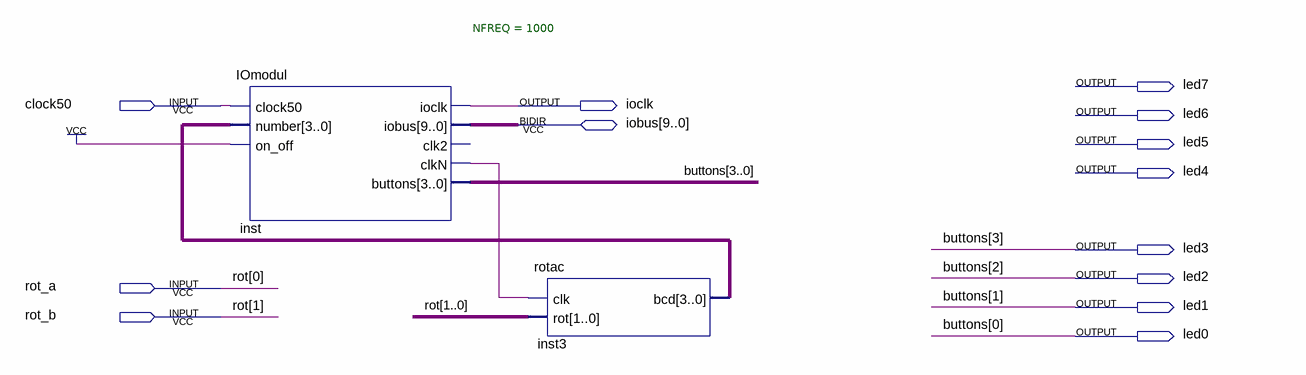
[diagram p0: schematic sheet]
// Quartus schematic logika.bdf as structural Verilog: 2 symbols, 13 pins
module logika (
  input  clock50,
  input  rot_a,
  input  rot_b,
  inout  [9:0] iobus,
  output led7,
  output ioclk,
  output led6,
  output led5,
  output led4,
  output led3,
  output led2,
  output led1,
  output led0
);

  wire inst_clkn;
  wire [3:0] inst3_bcd;

  IOmodul #(.NFREQ(1000)) inst (
    .clock50(clock50), .number(inst3_bcd), .on_off(1'b1), .ioclk(ioclk), .clkN(inst_clkn),
    .buttons({led3, led2, led1, led0}), .iobus(iobus));  // open: clk2
  rotac inst3 (.clk(inst_clkn), .rot({rot_b, rot_a}), .bcd(inst3_bcd));

  // Other names for the same wires on the sheet: buttons[3:0] = {led3, led2, led1, led0}; rot[1:0] = {rot_b, rot_a}
endmodule
